# EAGLE design 1-8 (EAGLE 9.6.2)
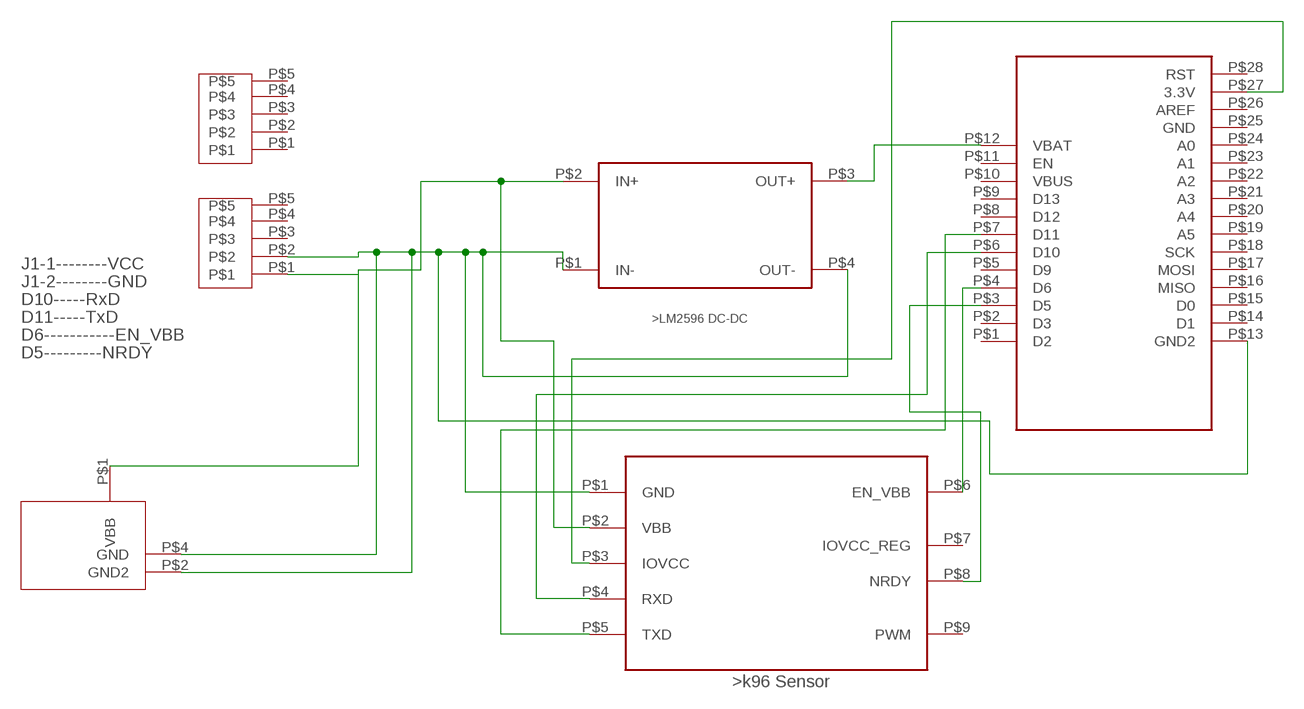
[diagram p0: schematic, sheet 1]

## Parts
DCDC1  DCDC  [DCDC]
FEATHER1  FEATHER  [FEATHER]
K96SENSOR1  K96SENSOR  [K96SENSOR]
PIN1  PIN  [PIN]
PIN2  PIN  [PIN]
U$1  POWER  [POWERIN]

## Nets
N$1: DCDC1.P$2(IN+) K96SENSOR1.P$2(VBB) PIN2.P$1 U$1.P$1(VBB)
N$2: DCDC1.P$1(IN-) DCDC1.P$4(OUT-) FEATHER1.P$13(GND2) K96SENSOR1.P$1(GND) PIN2.P$2 U$1.P$2(GND2) U$1.P$4(GND)
N$3: FEATHER1.P$6(D10) K96SENSOR1.P$4(RXD)
N$4: DCDC1.P$3(OUT+) FEATHER1.P$12(VBAT)
N$5: FEATHER1.P$7(D11) K96SENSOR1.P$5(TXD)
N$6: FEATHER1.P$4(D6) K96SENSOR1.P$6(EN_VBB)
N$7: FEATHER1.P$3(D5) K96SENSOR1.P$8(NRDY)
N$9: FEATHER1.P$27(3.3V) K96SENSOR1.P$3(IOVCC)
Unconnected: FEATHER1.P$1(D2) FEATHER1.P$2(D3) FEATHER1.P$5(D9) FEATHER1.P$8(D12) FEATHER1.P$9(D13) FEATHER1.P$10(VBUS) FEATHER1.P$11(EN) FEATHER1.P$14(D1) FEATHER1.P$15(D0) FEATHER1.P$16(MISO) FEATHER1.P$17(MOSI) FEATHER1.P$18(SCK) FEATHER1.P$19(A5) FEATHER1.P$20(A4) FEATHER1.P$21(A3) FEATHER1.P$22(A2) FEATHER1.P$23(A1) FEATHER1.P$24(A0) FEATHER1.P$25(GND) FEATHER1.P$26(AREF) FEATHER1.P$28(RST) K96SENSOR1.P$7(IOVCC_REG) K96SENSOR1.P$9(PWM) PIN1.P$1 PIN1.P$2 PIN1.P$3 PIN1.P$4 PIN1.P$5 PIN2.P$3 PIN2.P$4 PIN2.P$5

## Notes on the sheet
- J1-1--------VCC
- J1-2--------GND
- D10-----RxD
- D11-----TxD
- D6-----------EN_VBB
- D5---------NRDY

## Library data of the parts
DCDC1 = untitled:DCDC
FEATHER1 = untitled:FEATHER
K96SENSOR1 = untitled:K96SENSOR
PIN1 PIN2 = untitled:PIN
U$1 = untitled:POWER

## Board
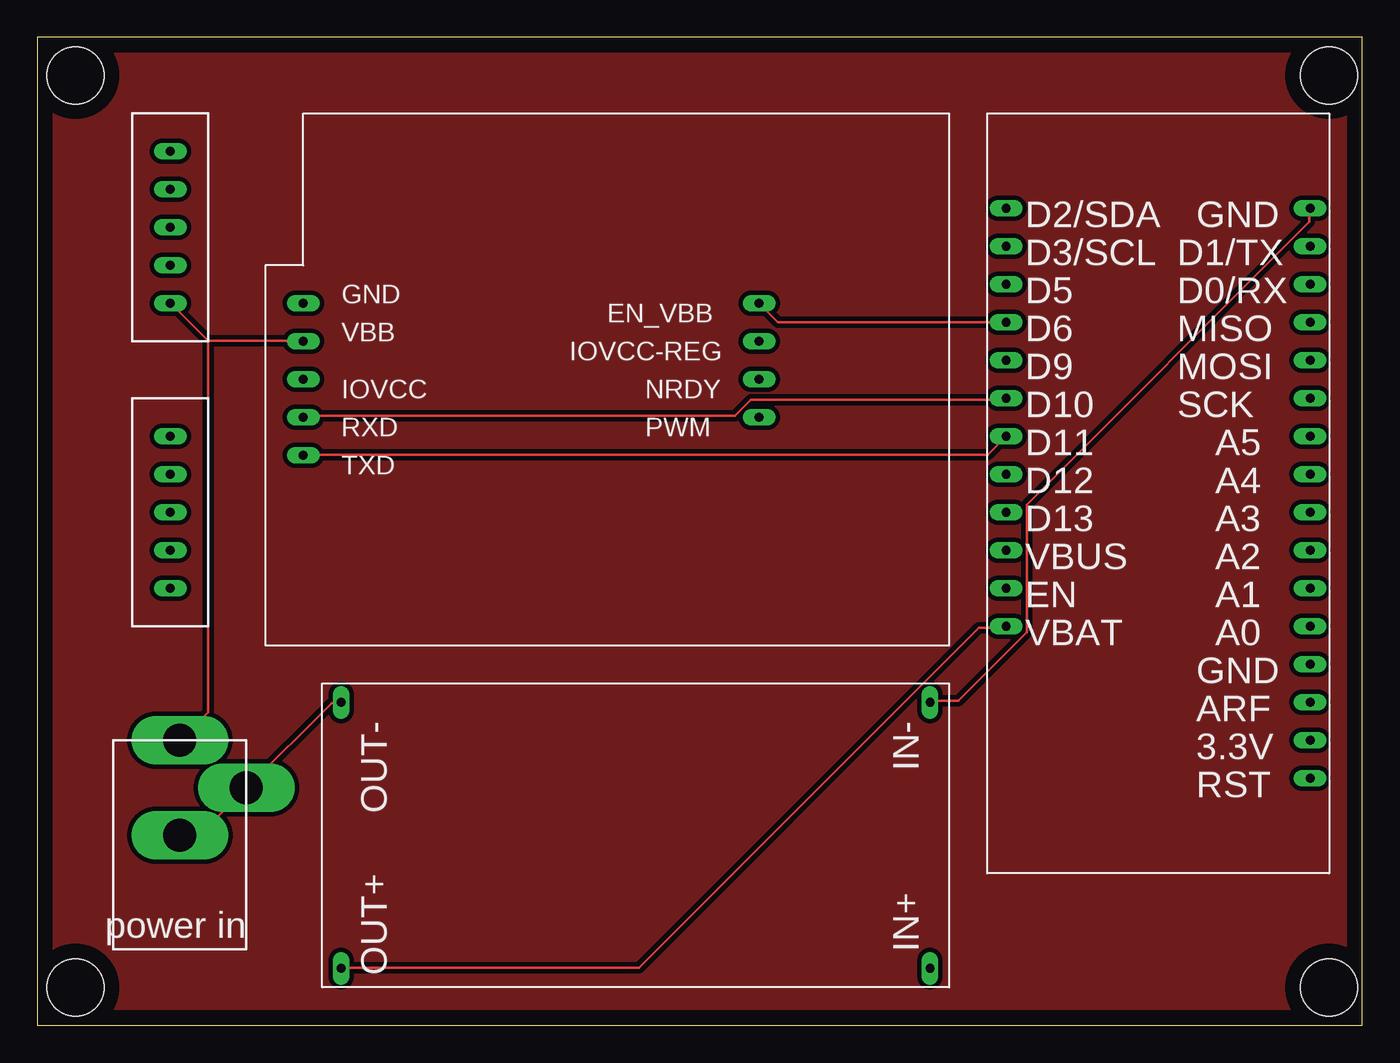
[diagram p1: board, top side]
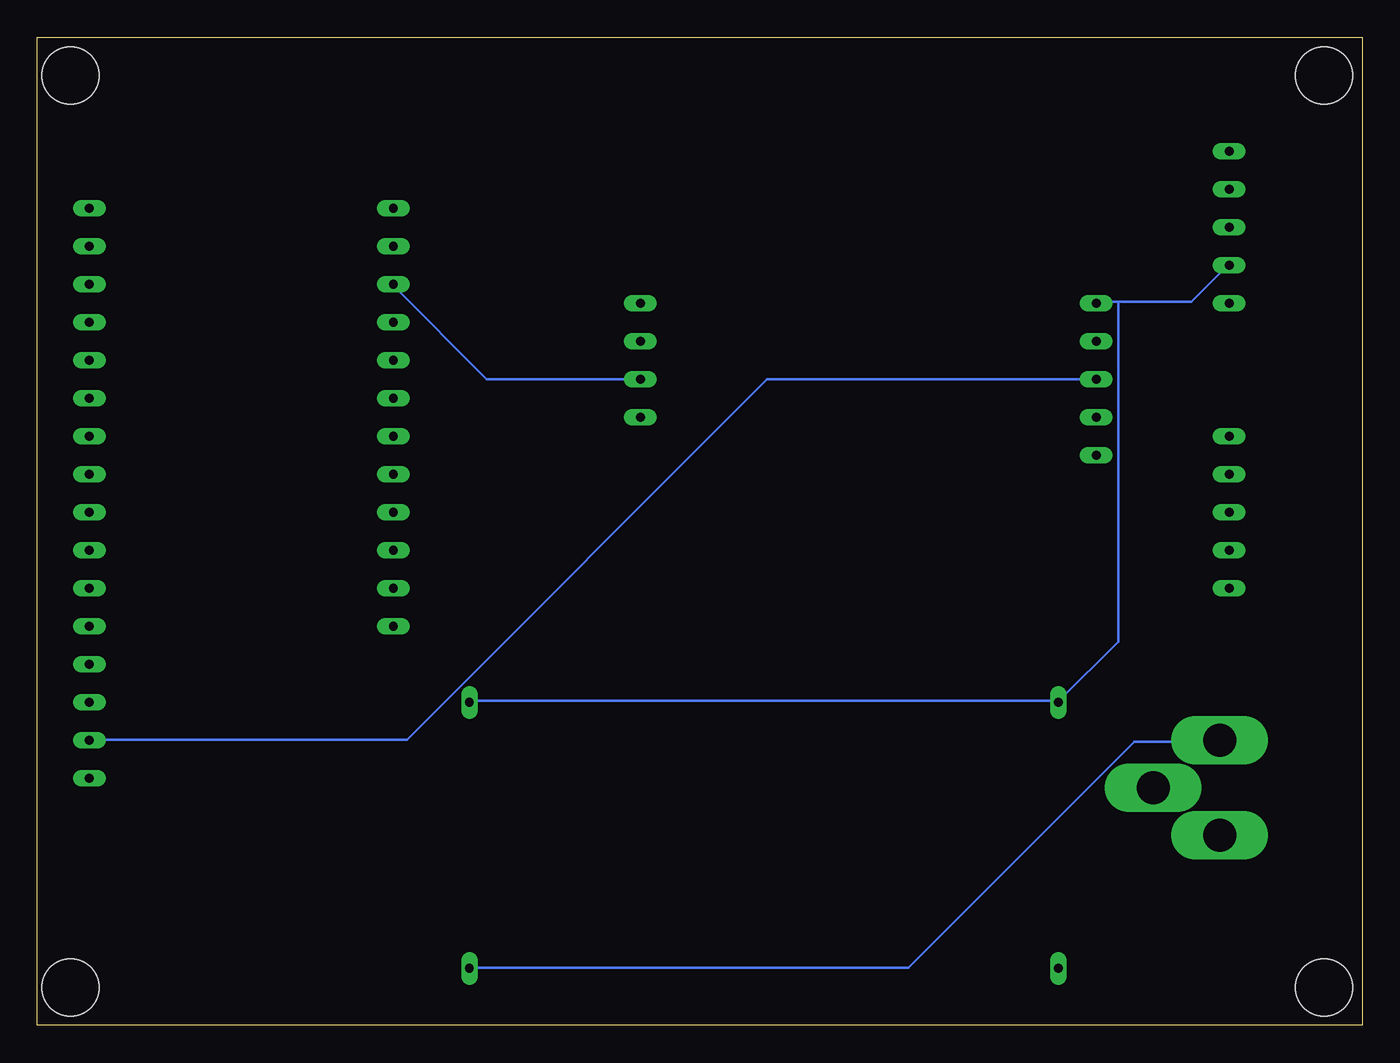
[diagram p2: board, bottom side, seen from below]

Size 88.57 x 66.03 mm. Coordinates in mm from the lower left corner, seen from the top.
Outline: 0,0 88.57,0 88.57,66.03 0,66.03 0,0
Copper layers (1*16): Top 0.035mm / dielectric 1.5mm / Bottom 0.035mm
Design rules "default": minimum track width 6mil, minimum drill 0.35mm, track to track 6mil, track to pad 6mil, pad to pad 6mil, via to via 6mil, smd to smd 6mil, copper to edge 40mil, drill to drill 6mil, minimum pad ring 10mil, minimum via ring 8mil, stop-mask expansion 4mil, vias tented up to drill 0mil, thermal gap 10mil
Holes 3.81 mm at 2.54,2.54 2.54,63.5 86.36,63.5 86.36,2.54

### Footprints (pad centres in the part's own frame; a part is rotated, then mirrored left to right if it is on the bottom)
DCDC = drill 0.6 long: P$1 -17.78,0; P$2 0,0; P$3 0,-39.37; P$4 -17.78,-39.37
FEATHER = drill 0.6 long: P$1 0,-5.08; P$2 0,-7.62; P$3 0,-10.16; P$4 0,-12.7; P$5 0,-15.24; P$6 0,-17.78; P$7 0,-20.32; P$8 0,-22.86; P$9 0,-25.4; P$10 0,-27.94; P$11 0,-30.48; P$12 0,-33.02; P$13 20.32,-5.08; P$14 20.32,-7.62; P$15 20.32,-10.16; P$16 20.32,-12.7; P$17 20.32,-15.24; P$18 20.32,-17.78; P$19 20.32,-20.32; P$20 20.32,-22.86; P$21 20.32,-25.4; P$22 20.32,-27.94; P$23 20.32,-30.48; P$24 20.32,-33.02; P$25 20.32,-35.56; P$26 20.32,-38.1; P$27 20.32,-40.64; P$28 20.32,-43.18
K96SENSOR = drill 0.6 long: P$1 -17.78,-5.08; P$2 -17.78,-7.62; P$3 -17.78,-10.16; P$4 -17.78,-12.7; P$5 -17.78,-15.24; P$6 12.7,-5.08; P$7 12.7,-7.62; P$8 12.7,-10.16; P$9 12.7,-12.7
PIN = drill 0.6 long: P$1 0,-7.62; P$2 0,-5.08; P$3 0,-2.54; P$4 0,0; P$5 0,2.54
POWERIN = drill 2.21 pad 2.032 long: P$1 4.445,-13.97; P$2 4.445,-7.62; P$4 0,-10.795

### Placement (x,y rotation side)
DCDC1  59.69,3.81 270 top
FEATHER1  64.77,59.69 0 top
K96SENSOR1  35.56,53.34 0 top
PIN1  8.89,36.83 0 top
PIN2  8.89,55.88 0 top
U$1  13.97,5.08 180 top

### Tracks (layer width: path | path; a pad name or v marks a point on that pad's centre or on a via)
GND
  pour Top (isolate 0.305): 0,66.04 88.9,66.04 88.9,0 0,0
N$1
  Top 0.152: 11.43,45.77 17.68,45.77 K96SENSOR1.P$2 | 11.43,45.77 8.99,48.21 PIN2.P$1 | 11.43,45.77 11.43,20.93 9.6,19.1 U$1.P$1
  Bottom 0.152: DCDC1.P$2 59.59,3.86 30.33,3.86 15.24,18.95 9.6,18.95 U$1.P$1
N$2
  Top 0.152: DCDC1.P$4 20.27,21.54 19.66,21.54 14.02,15.9 U$1.P$4 13.87,15.75 10.82,12.7 U$1.P$2 | FEATHER1.P$13 85.04,54.61 85.04,53.7 66.14,34.8 66.14,26.26 61.57,21.69 59.74,21.69 DCDC1.P$1
  Bottom 0.152: 16.31,48.36 11.43,48.36 8.99,50.8 PIN2.P$2 | 16.31,48.36 17.68,48.36 K96SENSOR1.P$1 | DCDC1.P$1 59.59,21.69 20.42,21.69 DCDC1.P$4 20.27,21.69 16.31,25.65 16.31,48.36
N$3
  Top 0.152: K96SENSOR1.P$4 17.83,40.74 46.63,40.74 47.7,41.81 64.77,41.81 FEATHER1.P$6
N$4
  Top 0.152: DCDC1.P$3 20.42,3.86 40.23,3.86 62.94,26.57 64.77,26.57 FEATHER1.P$12
N$5
  Top 0.152: FEATHER1.P$7 63.55,38.15 17.83,38.15 K96SENSOR1.P$5
N$6
  Top 0.152: FEATHER1.P$4 49.53,46.99 K96SENSOR1.P$6
N$7
  Bottom 0.152: K96SENSOR1.P$8 58.52,43.18 64.77,49.43 FEATHER1.P$3
N$9
  Bottom 0.152: K96SENSOR1.P$3 39.78,43.18 63.86,19.1 85.04,19.1 FEATHER1.P$27

### Text on the board
tValues: GND | VCC